# EAGLE schematic V0p2_Main_PCB2 (EAGLE 6.5.0)
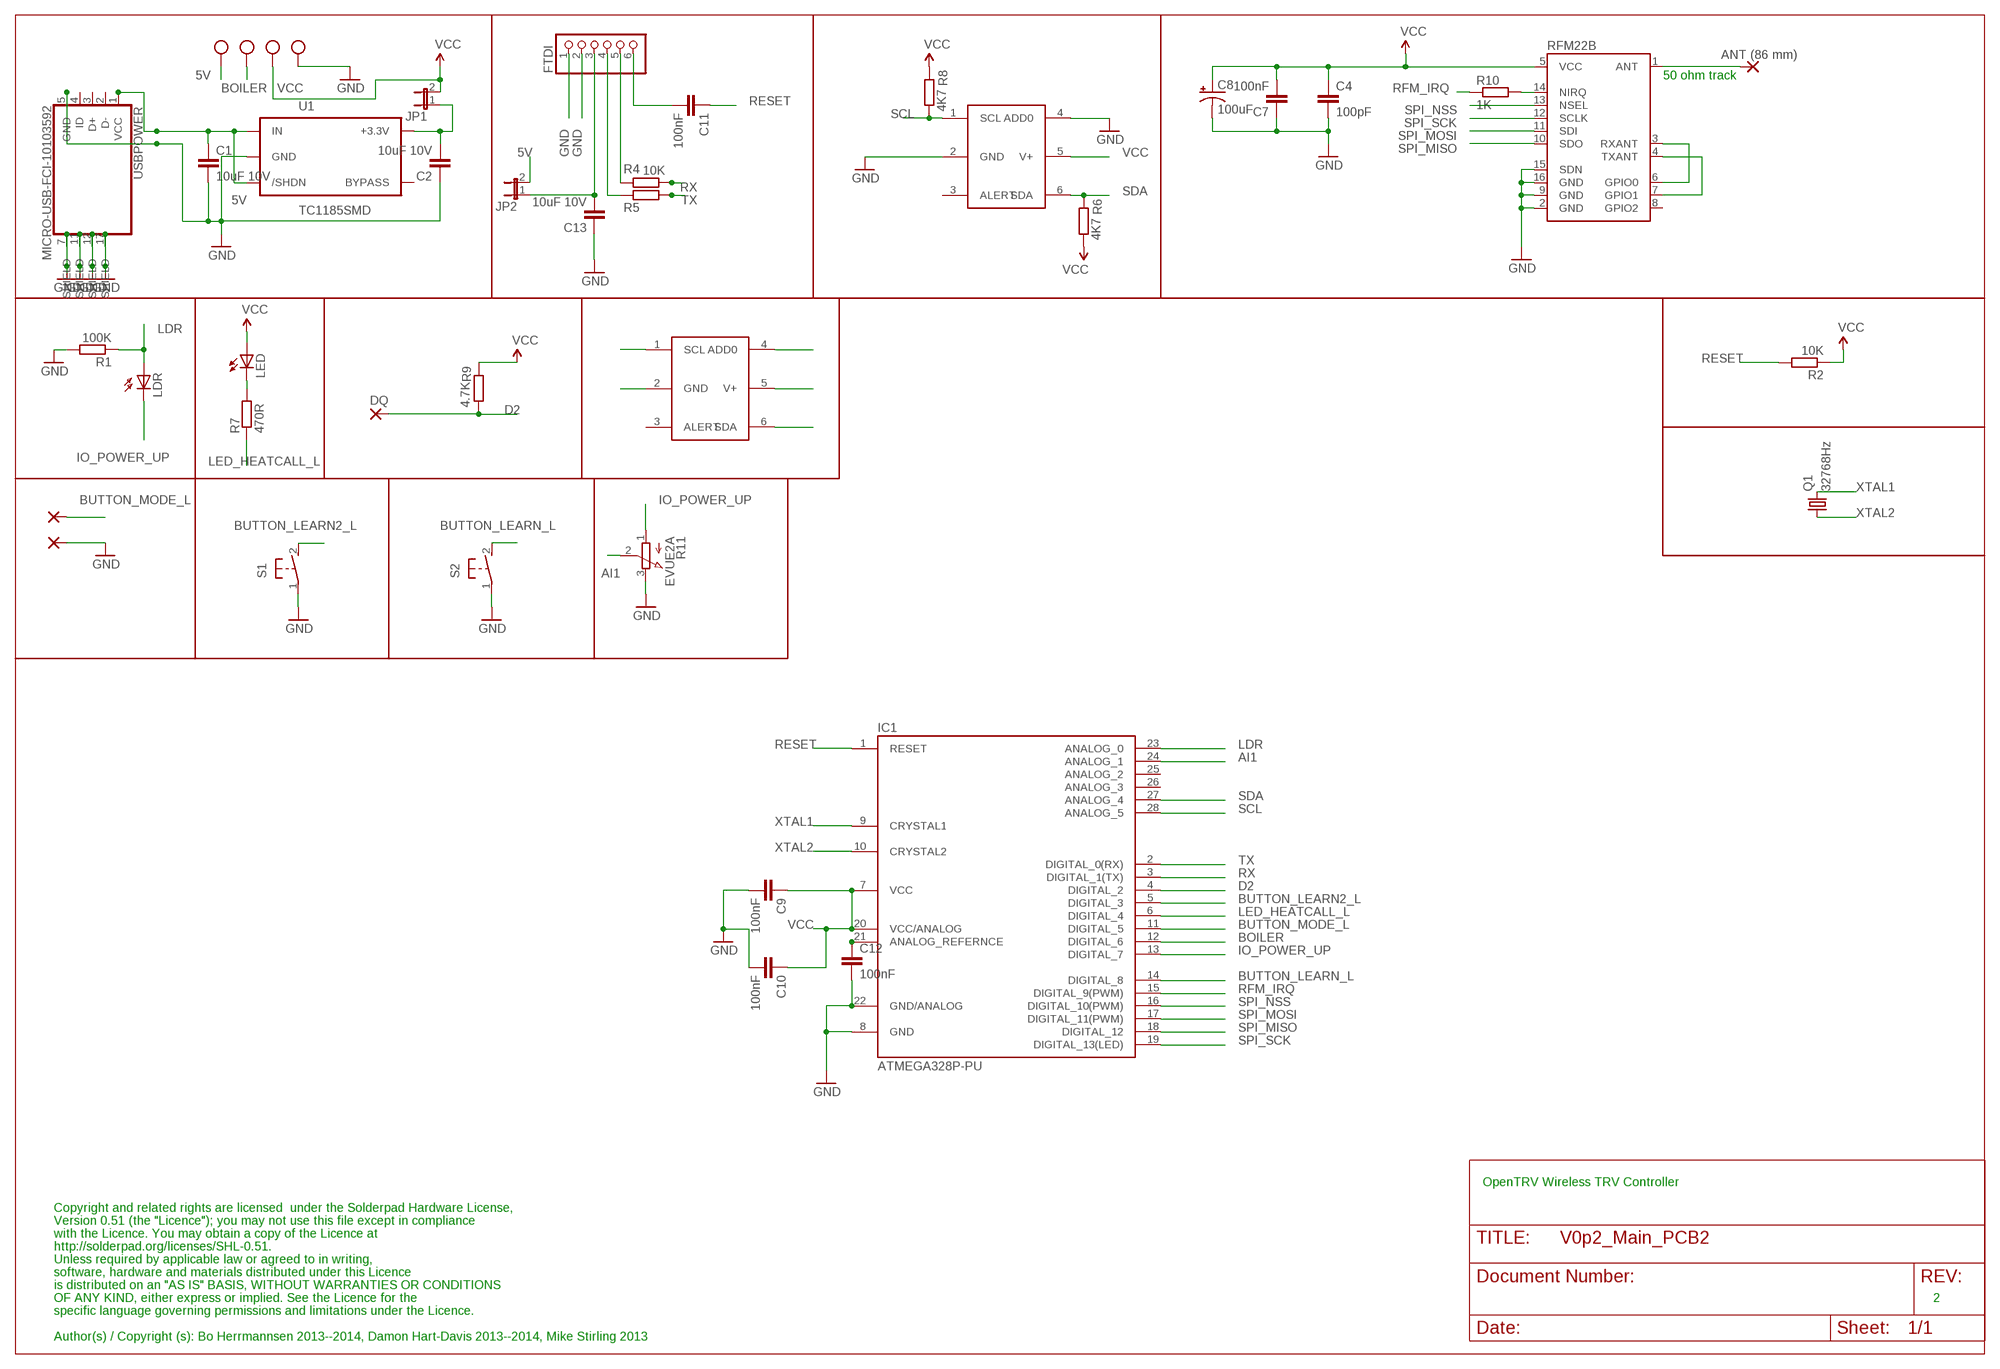
[diagram p0: schematic, sheet 1]

## Parts
ANT  ANT (86 mm)  2,15/1,0  [2,15/1,0]
C1  10uF 10V  CAP0603-CAP  [0603-CAP]
C2  10uF 10V  CAP0603-CAP  [0603-CAP]
C4  100pF  CAP0603-CAP  [0603-CAP]
C7  100nF  CAP0603-CAP  [0603-CAP]
C8  100uF  CAP_POL1206  [EIA3216]
C9  100nF  CAP0603-CAP  [0603-CAP]
C10  100nF  CAP0603-CAP  [0603-CAP]
C11  100nF  CAP0603-CAP  [0603-CAP]
C12  100nF  CAP0603-CAP  [0603-CAP]
C13  10uF 10V  CAP0603-CAP  [0603-CAP]
DQ  2,15/1,0  [2,15/1,0]
FTDI  PINHD-1X6/90  [1X06/90]
IC1  ATMEGA328P-PU  ATMEGA8-PU  [DIL28-3]
JP1  JP1E  [JP1]
JP2  JP1E  [JP1]
LDR  BPX65  [BPX65]
LED  LED3MM  [LED3MM]
MODE  2,15/1,0  [2,15/1,0]
MODE1  2,15/1,0  [2,15/1,0]
Q1  32768Hz  MC-306  [MC-306]
R1  100K  R-EU_R0603  [R0603]
R2  10K  R-EU_R0603  [R0603]
R4  10K  R-EU_R0603  [R0603]
R5  10K  R-EU_R0603  [R0603]
R6  4K7  R-EU_R0603  [R0603]
R7  470R  R-EU_R0603  [R0603]
R8  4K7  R-EU_R0603  [R0603]
R9  4.7K  R-EU_R0603  [R0603]
R10  1K  R-EU_R0603  [R0603]
R11  EVUE2A  [EVUE]
RFM22B  RFM22SMD  [RFM22-XXX-S2]
S1  31-XX  [B3F-31XX]
S2  31-XX  [B3F-31XX]
TMP  TMP112  [TMP112]
U1  TC1185SMD  [TC1185]
U$3  TMP  TMP112  [TMP112]
USBPOWER  MICRO-USB-FCI-10103592  [MICRO-USB-FCI-10103592]
X1  W237-102  [SCREWTERMINAL]
X2  W237-102  [SCREWTERMINAL]

## Nets
5V [supply]: C1.1 JP2.2 U1.1(IN) U1.3(/SHDN) USBPOWER.1(VCC) X1.2
AI1: IC1.24(ANALOG_1) R11.2(S)
BOILER: IC1.12(DIGITAL_6) X1.1
BUTTON_LEARN2_L: IC1.5(DIGITAL_3) S1.2(S)
BUTTON_LEARN_L: IC1.14(DIGITAL_8) S2.2(S)
BUTTON_MODE_L: IC1.11(DIGITAL_5) MODE1.1(P)
D2: DQ.1(P) IC1.4(DIGITAL_2) R9.1
GND [supply]: C1.2 C2.1 C4.2 C7.1 C8.C(-) C9.2 C10.2 C12.2 C13.1 FTDI.1 FTDI.2 IC1.8(GND) IC1.22(GND/ANALOG) MODE.1(P) R1.2 R11.3(E) RFM22B.2(GND) RFM22B.9(GND) RFM22B.15(SDN) RFM22B.16(GND) S1.1(P) S2.1(P) TMP.2(GND) TMP.4(ADD0) U1.2(GND) U$3.2(GND) U$3.4(ADD0) USBPOWER.5(GND) USBPOWER.7(SHIELD) USBPOWER.11(SHIELD) USBPOWER.12(SHIELD) USBPOWER.17(SHIELD) X2.2
IO_POWER_UP [supply]: IC1.13(DIGITAL_7) LDR.K(C) R11.1(A)
LDR: IC1.23(ANALOG_0) LDR.A R1.1
LED_HEATCALL_L: IC1.6(DIGITAL_4) R7.1
N$1: C11.2 FTDI.6
N$3: FTDI.4 R5.2
N$5: FTDI.5 R4.2
N$6 [supply]: C12.1 IC1.21(ANALOG_REFERNCE)
N$7: R10.2 RFM22B.14(NIRQ)
N$8 [supply]: C2.2 JP1.1 U1.5(+3.3V)
N$11 [supply]: C13.2 FTDI.3 JP2.1
N$13: LED.K(C) R7.2
N$20: RFM22B.3(RXANT) RFM22B.6(GPIO0)
N$21: RFM22B.4(TXANT) RFM22B.7(GPIO1)
N$26 [ant]: ANT.1(P) RFM22B.1(ANT)
RESET: C11.1 IC1.1(RESET) R2.2
RFM_IRQ: IC1.15(DIGITAL_9(PWM)) R10.1
RX: IC1.3(DIGITAL_1(TX)) R4.1
SCL: IC1.28(ANALOG_5) R8.1 TMP.1(SCL) U$3.1(SCL)
SDA: IC1.27(ANALOG_4) R6.2 TMP.6(SDA) U$3.6(SDA)
SPI_MISO: IC1.18(DIGITAL_12) RFM22B.10(SDO)
SPI_MOSI: IC1.17(DIGITAL_11(PWM)) RFM22B.11(SDI)
SPI_NSS: IC1.16(DIGITAL_10(PWM)) RFM22B.13(NSEL)
SPI_SCK: IC1.19(DIGITAL_13(LED)) RFM22B.12(SCLK)
TX: IC1.2(DIGITAL_0(RX)) R5.1
VCC [supply]: C4.1 C7.2 C8.A(+) C9.1 C10.1 IC1.7(VCC) IC1.20(VCC/ANALOG) JP1.2 LED.A R2.1 R6.1 R8.2 R9.2 RFM22B.5(VCC) TMP.5(V+) U$3.5(V+) X2.1
XTAL1: IC1.9(CRYSTAL1) Q1.4
XTAL2: IC1.10(CRYSTAL2) Q1.1
Unconnected: IC1.25(ANALOG_2) IC1.26(ANALOG_3) RFM22B.8(GPIO2) TMP.3(ALERT) U1.4(BYPASS) U$3.3(ALERT) USBPOWER.2(D-) USBPOWER.3(D+) USBPOWER.4(ID)

## Notes on the sheet
- 50 ohm track
- OpenTRV Wireless TRV Controller
- Copyright and related rights are licensed  under the Solderpad Hardware License,
- Version 0.51 (the "Licence"); you may not use this file except in compliance
- with the Licence. You may obtain a copy of the Licence at
- http://solderpad.org/licenses/SHL-0.51.
- Unless required by applicable law or agreed to in writing,
- software, hardware and materials distributed under this Licence
- is distributed on an "AS IS" BASIS, WITHOUT WARRANTIES OR CONDITIONS
- OF ANY KIND, either express or implied. See the Licence for the | 2
- specific language governing permissions and limitations under the Licence.
- Author(s) / Copyright (s): Bo Herrmannsen 2013--2014, Damon Hart-Davis 2013--2014, Mike Stirling 2013

## Library data of the parts
ANT DQ MODE MODE1 = wirepad:2,15/1,0: THROUGH-HOLE PAD
C1 C2 C4 C7 C9-C13 = SparkFun-Passives:CAP: Capacitor Standard 0603 ceramic capacitor, and 0.1" leaded capacitor.
C8 = SparkFun-Passives:CAP_POL: Capacitor Polarized These are standard SMD and PTH capacitors. Normally 10uF, 47uF, and 100uF in electrolytic and tantalum varieties. Always verify the external diameter of the through hole cap, it varies with capacity, voltage, and manufacturer. The EIA devices should be standard.
FTDI = pinhead:PINHD-1X6: PIN HEADER
IC1 = Arduino-AVR:ATMEGA8-PU
JP1 JP2 = jumper:JP1E: JUMPER
LDR = opto-trans-siemens:BPX65: PHOTO DIODE; MPN: BPX65.; OC_FARNELL: 327451; OC_NEWARK: 06WX2764
LED = adafruit:LED: LED OSRAM: - CHIPLED LG R971, LG N971, LY N971, LG Q971, LY Q971, LO R971, LY R971 LH N974, LH R974 LS Q976, LO Q976, LY Q976 LO Q996 - Hyper CHIPLED LW Q18S LB Q993, LB Q99A, LB R99A - SideLED LS A670, LO A670, LY A670, LG A670, LP A670 LB A673, LV A673, LT A673, LW A673 LH A674 LY A675 LS A676, LA A676, LO A676, LY A676, LW A676 LS A679, LY A679, LG A679 - Hyper Micro SIDELED® LS Y876, LA Y876, LO Y876, LY Y876 LT Y87S - SmartLED LW L88C, LW L88S LB L89C, LB L89S, LG L890 LS L89K, LO L89K, LY L89K LS L896, LA L896, LO L896, LY L896 - TOPLED LS T670, LO T670, LY T670, LG T670, LP T670 LSG T670, LSP T670, LSY T670, LOP T670, LYG T670 LG T671, LOG T671, LSG T671 LB T673, LV T673, LT T673, LW T673 LH T674 LS T676, LA T676, LO T676, LY T676, LB T676, LH T676, LSB T676, LW T676 LB T67C, LV T67C, LT T67C, LS T67K, LO T67K, LY T67K, LW E67C LS E67B, LA E67B, LO E67B, LY E67B, LB E67C, LV E67C, LT E67C LW T67C LS T679, LY T679, LG T679 LS T770, LO T770, LY T770, LG T770, LP T770 LB T773, LV T773, LT T773, LW T773 LH T774 LS E675, LA E675, LY E675, LS T675 LS T776, LA T776, LO T776, LY T776, LB T776 LHGB T686 LT T68C, LB T68C - Hyper Mini TOPLED® LB M676 - Mini TOPLED Santana® LG M470 LS M47K, LO M47K, LY M47K Source: http://www.osram.convergy.de/
Q1 = crystal:MC-306: kHz RANGE CRYSTAL UNIT SMD Source: MC-306_405_406_E07X.PDF Homepage <http://www.epsontoyocom.co.jp>; MPN: MC-306 60.0KHZ 100PPM ,12.5PF; OC_FARNELL: 1278040; OC_NEWARK: 31M5576
R1 R2 R4-R10 = resistor:R-EU_: RESISTOR, European symbol
R11 = pot:EVU: 9 mm Square Rotary Potentiometers Source: Panasonic
RFM22B = SparkFun-RF:RFM22: The RFM22 is a low-power, low cost radio that is capable of operating in the 434MHz and 900MHz open bands. It's frequency is software defined and there are some very good libraries written for it.
S1 S2 = adafruit:31-XX: OMRON SWITCH Now with beefier pads!
TMP = TMP112:TMP112
U1 = 3.3VREG:TC1185
U$3 = TMP112_2:TMP112
USBPOWER = micro-usb-fci-10103592:MICRO-USB-FCI-10103592: Micro USB B Connector RS No: 714-2334 MRF No: 10103592-0001LF
X1 X2 = screwterminal:W237-102: Screw terminal 3.5mm Pitch RS No: 710-0444 MRF No:1776275-2; MPN: 237-102; OC_FARNELL: unknown; OC_NEWARK: 70K9898

## Net classes
0 default: width 0.203 mm
1 supply: width 0.406 mm, clearance 0.203 mm
2 ant: width 2.184 mm